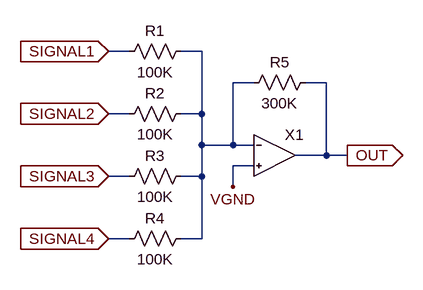
[diagram p0: schematic mixer.asc]
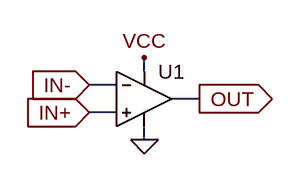
[diagram p1: sub-circuit opamp.asc]
mixer.asc, the LTspice schematic file:
Version 4
SHEET 1 880 680
WIRE 128 16 96 16
WIRE 240 16 208 16
WIRE 320 64 288 64
WIRE 432 64 400 64
WIRE 128 112 96 112
WIRE 240 112 240 16
WIRE 240 112 208 112
WIRE 240 160 240 112
WIRE 288 160 288 64
WIRE 288 160 240 160
WIRE 320 160 288 160
WIRE 432 176 432 64
WIRE 432 176 384 176
WIRE 464 176 432 176
WIRE 320 192 288 192
WIRE 128 208 96 208
WIRE 240 208 240 160
WIRE 240 208 208 208
WIRE 288 224 288 192
WIRE 128 304 96 304
WIRE 240 304 240 208
WIRE 240 304 208 304
FLAG 96 16 SIGNAL1
IOPIN 96 16 In
FLAG 96 112 SIGNAL2
IOPIN 96 112 In
FLAG 96 208 SIGNAL3
IOPIN 96 208 In
FLAG 96 304 SIGNAL4
IOPIN 96 304 In
FLAG 288 224 VGND
FLAG 464 176 OUT
IOPIN 464 176 Out
SYMBOL res 224 0 R90
WINDOW 0 0 56 VBottom 2
WINDOW 3 32 56 VTop 2
SYMATTR InstName R1
SYMATTR Value 100K
SYMBOL res 224 96 R90
WINDOW 0 0 56 VBottom 2
WINDOW 3 32 56 VTop 2
SYMATTR InstName R2
SYMATTR Value 100K
SYMBOL res 224 192 R90
WINDOW 0 0 56 VBottom 2
WINDOW 3 32 56 VTop 2
SYMATTR InstName R3
SYMATTR Value 100K
SYMBOL res 224 288 R90
WINDOW 0 0 56 VBottom 2
WINDOW 3 32 56 VTop 2
SYMATTR InstName R4
SYMATTR Value 100K
SYMBOL opamp 352 176 R0
SYMATTR InstName X1
SYMBOL res 416 48 R90
WINDOW 0 0 56 VBottom 2
WINDOW 3 32 56 VTop 2
SYMATTR InstName R5
SYMATTR Value 300K

opamp.asc, the sub-circuit schematic file:
Version 4
SHEET 1 880 680
WIRE 144 144 144 128
WIRE 112 160 80 160
WIRE 208 176 176 176
WIRE 112 192 80 192
WIRE 144 224 144 208
FLAG 144 224 0
FLAG 144 128 VCC
FLAG 208 176 OUT
IOPIN 208 176 Out
FLAG 80 192 IN+
IOPIN 80 192 In
FLAG 80 160 IN-
IOPIN 80 160 In
SYMBOL Opamps\\UniversalOpamp2 144 176 R0
SYMATTR InstName U1
SYMATTR Value2 Avol=1Meg GBW=1.2Meg Slew=10Meg

The netlist it stands for:
* mixer.asc
R1 N001 SIGNAL1 100K
R2 N001 SIGNAL2 100K
R3 N001 SIGNAL3 100K
R4 N001 SIGNAL4 100K
XX1 VGND N001 OUT opamp
R5 OUT N001 300K

* block symbol definitions
.subckt opamp IN+ IN- OUT
XU1 IN+ IN- VCC 0 OUT level.2 Avol=1Meg GBW=1.2Meg Slew=10Meg ilimit=25m rail=0 Vos=0 phimargin=45 en=0 enk=0 in=0 ink=0 Rin=500Meg  ; pins IN+ IN- V+ V- OUT
.ends opamp

.lib UniversalOpamps2.sub
.backanno
.end